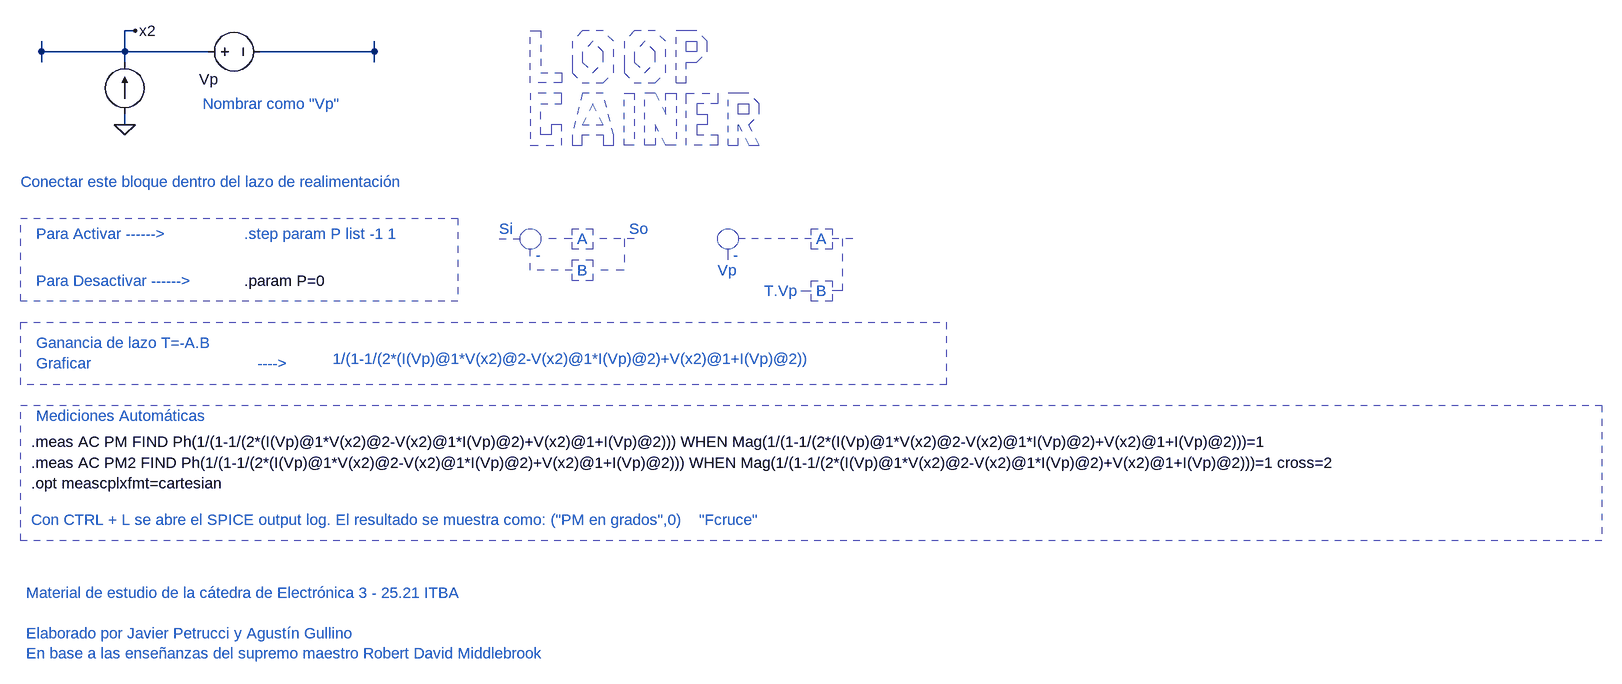
[diagram p0: schematic Loop Gainer - E3.asc]
Loop Gainer - E3.asc, the LTspice schematic file:
Version 4.1
SHEET 1 1444 816
WIRE -816 -368 -832 -368
WIRE -960 -336 -960 -352
WIRE -832 -336 -832 -368
WIRE -832 -336 -960 -336
WIRE -704 -336 -832 -336
WIRE -448 -336 -448 -352
WIRE -448 -336 -624 -336
WIRE -960 -320 -960 -336
WIRE -832 -320 -832 -336
WIRE -448 -320 -448 -336
WIRE -832 -224 -832 -240
FLAG -832 -224 0
FLAG -816 -368 x2
SYMBOL current -832 -240 M180
WINDOW 0 15 0 Invisible 2
WINDOW 3 24 0 Invisible 2
SYMATTR InstName I1
SYMATTR Value ""
SYMATTR Value2 AC {u(P)}
SYMBOL voltage -720 -336 M90
WINDOW 0 27 17 VTop 2
WINDOW 3 -32 56 VBottom 2
SYMATTR InstName Vp
SYMATTR Value ""
SYMATTR Value2 AC {u(-P)}
TEXT -512 136 Left 2 ;1/(1-1/(2*(I(Vp)@1*V(x2)@2-V(x2)@1*I(Vp)@2)+V(x2)@1+I(Vp)@2))
TEXT -648 -56 Left 2 ;.step param P list -1 1
TEXT -648 16 Left 2 !.param P=0
TEXT -712 -256 Left 2 ;Nombrar como "Vp"
TEXT -968 112 Left 2 ;Ganancia de lazo T=-A.B\nGraficar                                     ---->
TEXT -968 16 Left 2 ;Para Desactivar ------>
TEXT -968 -56 Left 2 ;Para Activar ------>
TEXT -984 496 Left 2 ;Material de estudio de la cátedra de Electrónica 3 - 25.21 ITBA\n \nElaborado por Javier Petrucci y Agustín Gullino\nEn base a las enseñanzas del supremo maestro Robert David Middlebrook
TEXT -976 384 Left 2 ;Con CTRL + L se abre el SPICE output log. El resultado se muestra como: ("PM en grados",0)    "Fcruce"
TEXT -976 264 Left 2 !.meas AC PM FIND Ph(1/(1-1/(2*(I(Vp)@1*V(x2)@2-V(x2)@1*I(Vp)@2)+V(x2)@1+I(Vp)@2))) WHEN Mag(1/(1-1/(2*(I(Vp)@1*V(x2)@2-V(x2)@1*I(Vp)@2)+V(x2)@1+I(Vp)@2)))=1
TEXT -976 328 Left 2 !.opt meascplxfmt=cartesian
TEXT -976 296 Left 2 !.meas AC PM2 FIND Ph(1/(1-1/(2*(I(Vp)@1*V(x2)@2-V(x2)@1*I(Vp)@2)+V(x2)@1+I(Vp)@2))) WHEN Mag(1/(1-1/(2*(I(Vp)@1*V(x2)@2-V(x2)@1*I(Vp)@2)+V(x2)@1+I(Vp)@2)))=1 cross=2
TEXT -968 224 Left 2 ;Mediciones Automáticas
TEXT -992 -136 Left 2 ;Conectar este bloque dentro del lazo de realimentación
TEXT -256 -64 Left 2 ;Si
TEXT -56 -64 Left 2 ;So
TEXT -200 -24 Left 2 ;-
TEXT -136 -48 Left 2 ;A
TEXT -136 0 Left 2 ;B
TEXT 104 -24 Left 2 ;-
TEXT 232 -48 Left 2 ;A
TEXT 232 32 Left 2 ;B
TEXT 80 0 Left 2 ;Vp
TEXT 152 32 Left 2 ;T.Vp
LINE Normal -144 -48 -192 -48 2
LINE Normal -208 0 -208 -32 2
LINE Normal -144 0 -208 0 2
LINE Normal -48 -48 -112 -48 2
LINE Normal -64 0 -112 0 2
LINE Normal -64 -48 -64 0 2
LINE Normal -256 -48 -224 -48 2
LINE Normal 224 -48 112 -48 2
LINE Normal 96 -16 96 -32 2
LINE Normal 288 -48 256 -48 2
LINE Normal 272 32 256 32 2
LINE Normal 272 -48 272 32 2
LINE Normal 96 -16 96 -16 2
LINE Normal 208 32 224 32 2
LINE Normal -208 -288 -208 -368 2
LINE Normal -160 -288 -208 -288 2
LINE Normal -160 -304 -160 -288 2
LINE Normal -192 -304 -160 -304 2
LINE Normal -192 -368 -192 -304 2
LINE Normal -208 -368 -192 -368 2
LINE Normal -144 -352 -144 -320 2
LINE Normal -128 -368 -144 -352 2
LINE Normal -96 -368 -128 -368 2
LINE Normal -80 -352 -96 -368 2
LINE Normal -80 -304 -80 -352 2
LINE Normal -96 -288 -80 -304 2
LINE Normal -128 -288 -96 -288 2
LINE Normal -144 -304 -128 -288 2
LINE Normal -144 -320 -144 -304 2
LINE Normal -112 -352 -128 -336 2
LINE Normal 16 -288 16 -368 2
LINE Normal 32 -368 16 -368 2
LINE Normal 48 -368 32 -368 2
LINE Normal 64 -352 48 -368 2
LINE Normal 64 -336 64 -352 2
LINE Normal 48 -320 64 -336 2
LINE Normal 32 -320 48 -320 2
LINE Normal 32 -288 32 -320 2
LINE Normal 16 -288 32 -288 2
LINE Normal 32 -336 32 -352 2
LINE Normal 48 -336 32 -336 2
LINE Normal 48 -352 48 -336 2
LINE Normal 32 -352 48 -352 2
LINE Normal -160 -272 -208 -272 2
LINE Normal -160 -256 -160 -272 2
LINE Normal -192 -256 -160 -256 2
LINE Normal -192 -208 -192 -256 2
LINE Normal -176 -208 -192 -208 2
LINE Normal -176 -224 -176 -208 2
LINE Normal -160 -224 -176 -224 2
LINE Normal -160 -192 -160 -224 2
LINE Normal -208 -192 -160 -192 2
LINE Normal -208 -272 -208 -192 2
LINE Normal -144 -208 -144 -192 2
LINE Normal -128 -272 -144 -208 2
LINE Normal -96 -272 -128 -272 2
LINE Normal -80 -208 -96 -272 2
LINE Normal -80 -192 -80 -208 2
LINE Normal -96 -192 -80 -192 2
LINE Normal -96 -208 -96 -192 2
LINE Normal -128 -208 -96 -208 2
LINE Normal -128 -192 -128 -208 2
LINE Normal -144 -192 -128 -192 2
LINE Normal -96 -224 -112 -256 2
LINE Normal -128 -224 -96 -224 2
LINE Normal -112 -256 -128 -224 2
LINE Normal -64 -192 -64 -272 2
LINE Normal -48 -192 -64 -192 2
LINE Normal -48 -272 -48 -192 2
LINE Normal -64 -272 -48 -272 2
LINE Normal -32 -192 -32 -272 2
LINE Normal -16 -272 -32 -272 2
LINE Normal -16 -192 -32 -192 2
LINE Normal -16 -224 -16 -192 2
LINE Normal 16 -272 16 -192 2
LINE Normal 0 -272 16 -272 2
LINE Normal 0 -240 0 -272 2
LINE Normal -16 -272 0 -240 2
LINE Normal 0 -192 -16 -224 2
LINE Normal 16 -192 0 -192 2
LINE Normal 32 -192 32 -256 2
LINE Normal 80 -192 32 -192 2
LINE Normal 80 -208 80 -192 2
LINE Normal 48 -208 80 -208 2
LINE Normal 48 -224 48 -208 2
LINE Normal 64 -224 48 -224 2
LINE Normal 64 -240 64 -224 2
LINE Normal 48 -240 64 -240 2
LINE Normal 48 -256 48 -240 2
LINE Normal 80 -256 48 -256 2
LINE Normal 80 -272 80 -256 2
LINE Normal 32 -272 80 -272 2
LINE Normal 32 -256 32 -272 2
LINE Normal 96 -192 96 -272 2
LINE Normal 112 -272 96 -272 2
LINE Normal 128 -272 112 -272 2
LINE Normal 144 -256 128 -272 2
LINE Normal 144 -240 144 -256 2
LINE Normal 128 -224 144 -240 2
LINE Normal 144 -192 128 -224 2
LINE Normal 128 -192 144 -192 2
LINE Normal 112 -224 128 -192 2
LINE Normal 112 -192 112 -224 2
LINE Normal 96 -192 112 -192 2
LINE Normal 112 -240 112 -256 2
LINE Normal 128 -240 112 -240 2
LINE Normal 128 -256 128 -240 2
LINE Normal 112 -256 128 -256 2
LINE Normal -96 -336 -112 -352 2
LINE Normal -96 -320 -96 -336 2
LINE Normal -112 -304 -96 -320 2
LINE Normal -128 -320 -112 -304 2
LINE Normal -128 -336 -128 -320 2
LINE Normal -64 -352 -64 -320 2
LINE Normal -48 -368 -64 -352 2
LINE Normal -16 -368 -48 -368 2
LINE Normal 0 -352 -16 -368 2
LINE Normal 0 -304 0 -352 2
LINE Normal -16 -288 0 -304 2
LINE Normal -48 -288 -16 -288 2
LINE Normal -64 -304 -48 -288 2
LINE Normal -64 -320 -64 -304 2
LINE Normal -32 -352 -48 -336 2
LINE Normal -16 -336 -32 -352 2
LINE Normal -16 -320 -16 -336 2
LINE Normal -32 -304 -16 -320 2
LINE Normal -48 -320 -32 -304 2
LINE Normal -48 -336 -48 -320 2
RECTANGLE Normal -320 48 -992 -80 2
RECTANGLE Normal 432 176 -992 80 2
RECTANGLE Normal 1440 416 -992 208 2
RECTANGLE Normal -112 -32 -144 -64 2
RECTANGLE Normal -112 16 -144 -16 2
RECTANGLE Normal 256 -32 224 -64 2
RECTANGLE Normal 256 48 224 16 2
CIRCLE Normal -192 -32 -224 -64 2
CIRCLE Normal 112 -32 80 -64 2

The netlist it stands for:
* Loop Gainer - E3.asc
I1 0 x2 AC {u(P)}
Vp x2 N001 AC {u(-P)}
* 1/(1-1/(2*(I(Vp)@1*V(x2)@2-V(x2)@1*I(Vp)@2)+V(x2)@1+I(Vp)@2))
* .step param P list -1 1
.param P=0
* Nombrar como "Vp"
* Ganancia de lazo T=-A.B
* Graficar                                     ---->
* Para Desactivar ------>
* Para Activar ------>
* Material de estudio de la cátedra de Electrónica 3 - 25.21 ITBA
* Elaborado por Javier Petrucci y Agustín Gullino
* En base a las enseñanzas del supremo maestro Robert David Middlebrook
* Con CTRL + L se abre el SPICE output log. El resultado se muestra como: ("PM en grados",0)    "Fcruce"
.meas AC PM FIND Ph(1/(1-1/(2*(I(Vp)@1*V(x2)@2-V(x2)@1*I(Vp)@2)+V(x2)@1+I(Vp)@2))) WHEN Mag(1/(1-1/(2*(I(Vp)@1*V(x2)@2-V(x2)@1*I(Vp)@2)+V(x2)@1+I(Vp)@2)))=1
.opt meascplxfmt=cartesian
.meas AC PM2 FIND Ph(1/(1-1/(2*(I(Vp)@1*V(x2)@2-V(x2)@1*I(Vp)@2)+V(x2)@1+I(Vp)@2))) WHEN Mag(1/(1-1/(2*(I(Vp)@1*V(x2)@2-V(x2)@1*I(Vp)@2)+V(x2)@1+I(Vp)@2)))=1 cross=2
* Mediciones Automáticas
* Conectar este bloque dentro del lazo de realimentación
* Si
* So
* -
* A
* B
* -
* A
* B
* Vp
* T.Vp
.backanno
.end